# EAGLE design CAN-Test-Board (EAGLE 9.6.2)

## Sheet 1 of 3
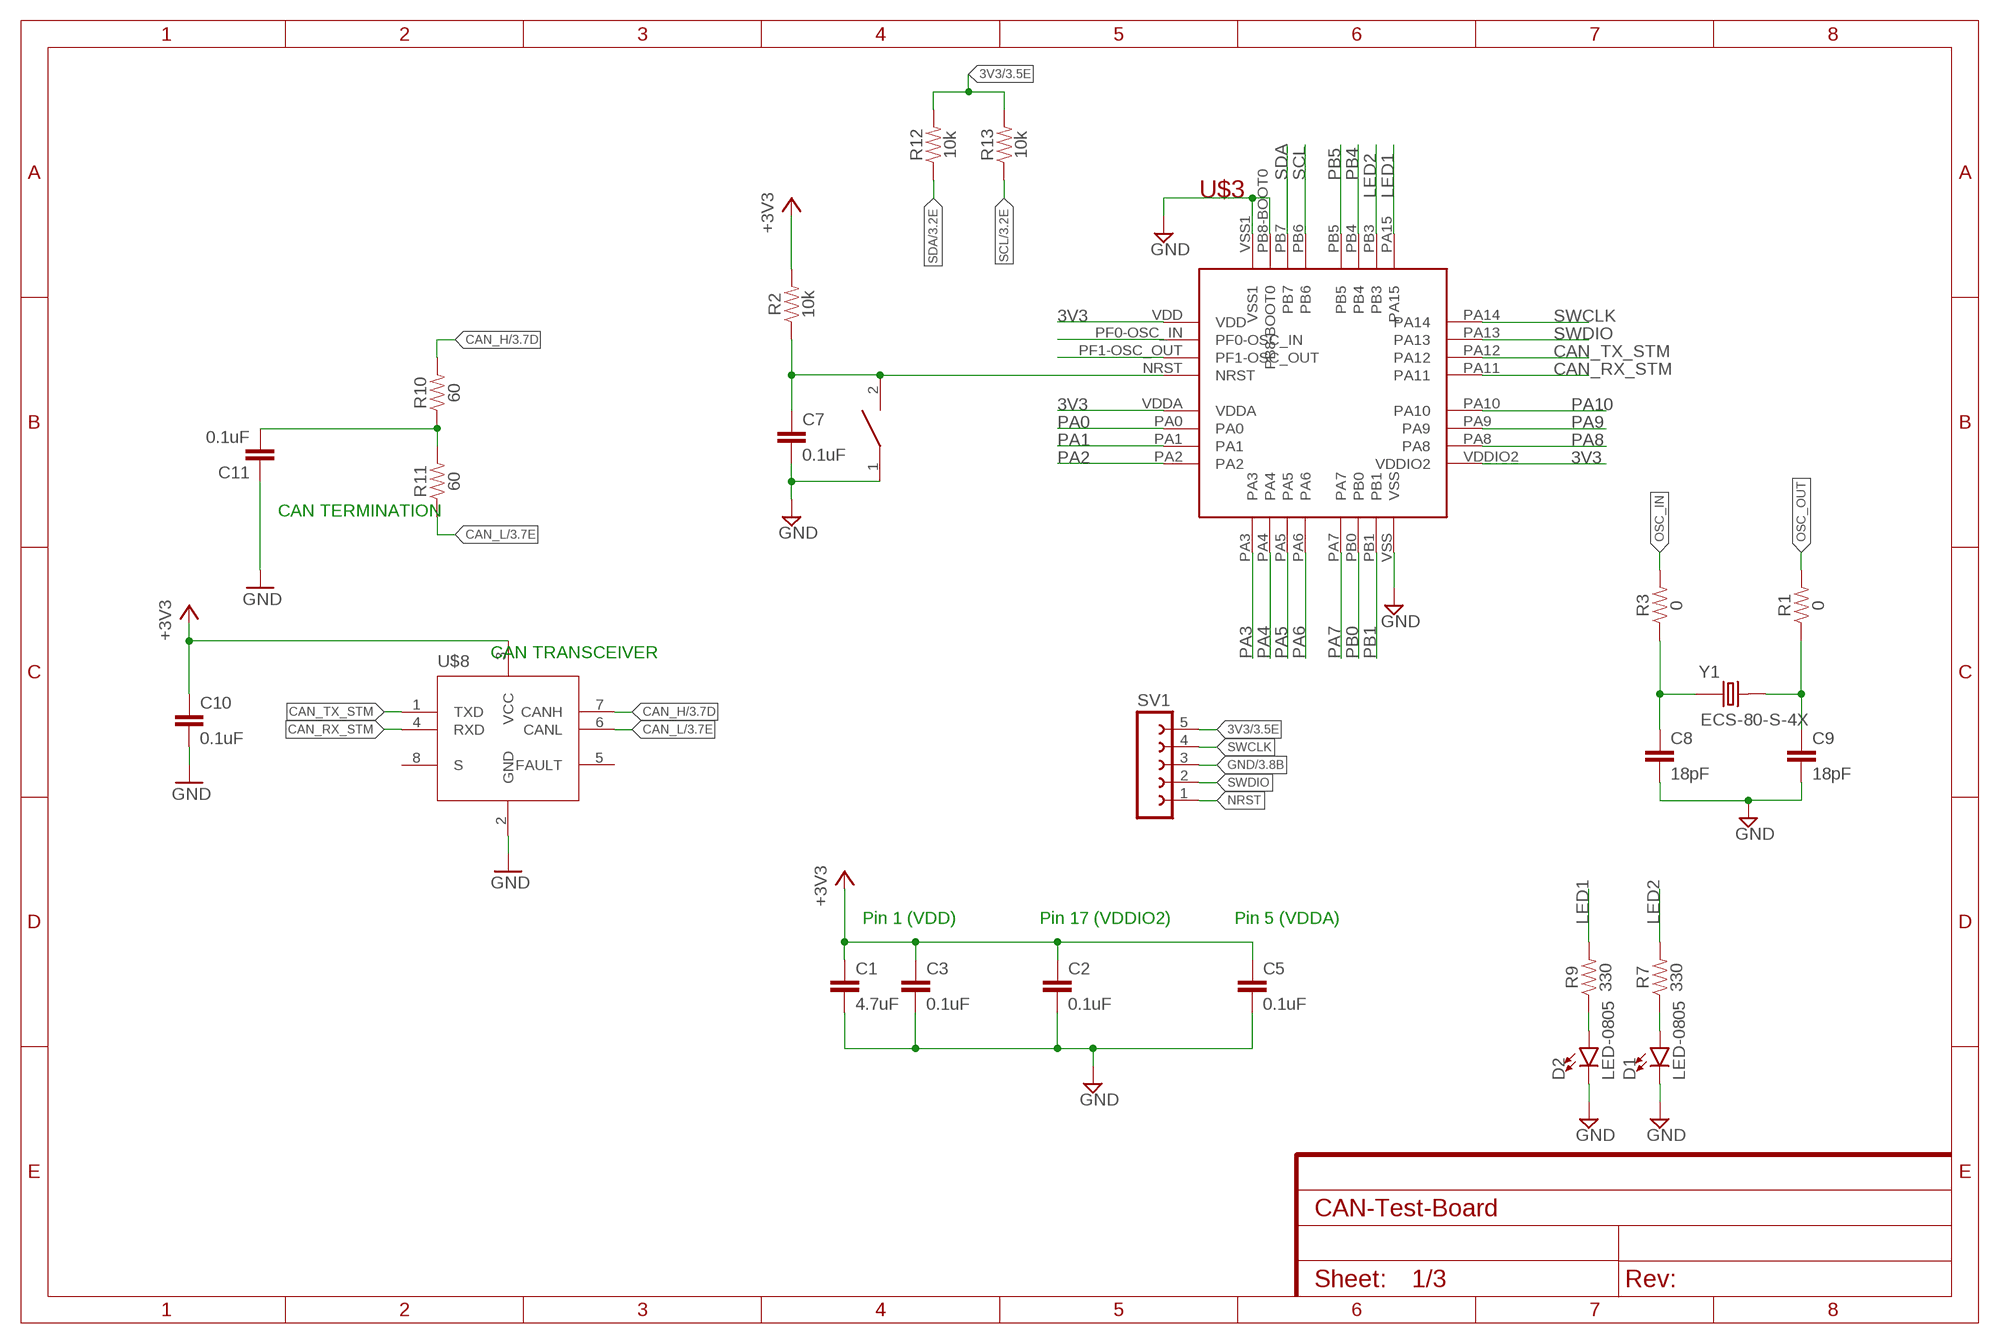
[diagram p0: schematic, sheet 1]

### Parts
C1  4.7uF  4.7UF0603  [0603]
C2  0.1uF  4.7UF0603  [0603]
C3  0.1uF  4.7UF0603  [0603]
C5  0.1uF  4.7UF0603  [0603]
C7  0.1uF  4.7UF0603  [0603]
C8  18pF  4.7UF0603  [0603]
C9  18pF  4.7UF0603  [0603]
C10  0.1uF  4.7UF0603  [0603]
C11  0.1uF  0.1UF-0603-25V-(+80/-20%)  [0603]
D1  LED-0805  [0805]
D2  LED-0805  [0805]
R1  0  1KOHM-0603-1/10W-1%  [0603]
R2  10k  1KOHM-0603-1/10W-1%  [0603]
R3  0  1KOHM-0603-1/10W-1%  [0603]
R7  330  RESISTOR0603  [0603]
R9  330  RESISTOR0603  [0603]
R10  60  1KOHM-0603-1/10W-1%  [0603]
R11  60  1KOHM-0603-1/10W-1%  [0603]
R12  10k  1KOHM-0603-1/10W-1%  [0603]
R13  10k  1KOHM-0603-1/10W-1%  [0603]
RESET  DISCRETECOMPONENTS_SWITCH  [DISCRETECOMPONENTS_SW_2512]
SV1  FE05-1  [FE05-1]
U$3  STM32F042K6T6  [STM32F042K6T6]
U$8  TCAN337D  [SOIC-8]
Y1  ECS-80-S-4X  [XTAL_ECS-80-S-4X]

### Nets
3V3 [Power]: C1.1 C2.1 C3.1 C5.1 C10.1 R2.2 R12.2 R13.2 SV1.5 U$3.VDD U$3.VDDA U$3.VDDIO2 U$8.3(VCC) ; supply symbol labelled +3V3 ; also sheet 2,3
CAN_H [GPIO]: R10.2 U$8.7(CANH) ; also sheet 2,3
CAN_L [GPIO]: R11.1 U$8.6(CANL) ; also sheet 2,3
CAN_RX_STM [GPIO]: U$3.PA11 U$8.4(RXD)
CAN_TX_STM [GPIO]: U$3.PA12 U$8.1(TXD)
GND: C1.2 C2.2 C3.2 C5.2 C7.2 C8.2 C9.2 C10.2 C11.1 D1.C D2.C RESET.1 SV1.3 U$3.PB8-BOOT0 U$3.VSS U$3.VSS1 U$8.2(GND) ; also sheet 2,3
LED1: R9.2 U$3.PA15
LED2: R7.2 U$3.PB3 ; also sheet 2
N$1: C9.1 R1.1 Y1.2
N$2: C8.1 R3.1 Y1.1
N$5: C11.2 R10.1 R11.2
N$13: D2.A R9.1
N$24: D1.A R7.1
NRST [GPIO]: C7.1 R2.1 RESET.2 SV1.1 U$3.NRST
OSC_IN [GPIO]: R3.2 U$3.PF0-OSC_IN
OSC_OUT [GPIO]: R1.2 U$3.PF1-OSC_OUT
PA0 [GPIO]: U$3.PA0 ; also sheet 2
PA1 [GPIO]: U$3.PA1 ; also sheet 2
PA2 [GPIO]: U$3.PA2 ; also sheet 2
PA3 [GPIO]: U$3.PA3 ; also sheet 2
PA4 [GPIO]: U$3.PA4 ; also sheet 2
PA5 [GPIO]: U$3.PA5 ; also sheet 2
PA6 [GPIO]: U$3.PA6 ; also sheet 2
PA7 [GPIO]: U$3.PA7 ; also sheet 2
PA8 [GPIO]: U$3.PA8 ; also sheet 2
PA9 [GPIO]: U$3.PA9 ; also sheet 2
PA10 [GPIO]: U$3.PA10 ; also sheet 2
PB0 [GPIO]: U$3.PB0 ; also sheet 2
PB1 [GPIO]: U$3.PB1 ; also sheet 2
PB4 [GPIO]: U$3.PB4 ; also sheet 2
PB5 [GPIO]: U$3.PB5 ; also sheet 2
SCL [GPIO]: R13.1 U$3.PB6 ; also sheet 2,3
SDA [GPIO]: R12.1 U$3.PB7 ; also sheet 2,3
SWCLK [GPIO]: SV1.4 U$3.PA14
SWDIO [GPIO]: SV1.2 U$3.PA13
Unconnected: U$8.5(FAULT) U$8.8(S)

### Notes on the sheet
- CAN TERMINATION
- CAN TRANSCEIVER
- Pin 1 (VDD) | Pin 17 (VDDIO2) | Pin 5 (VDDA)

## Sheet 2 of 3
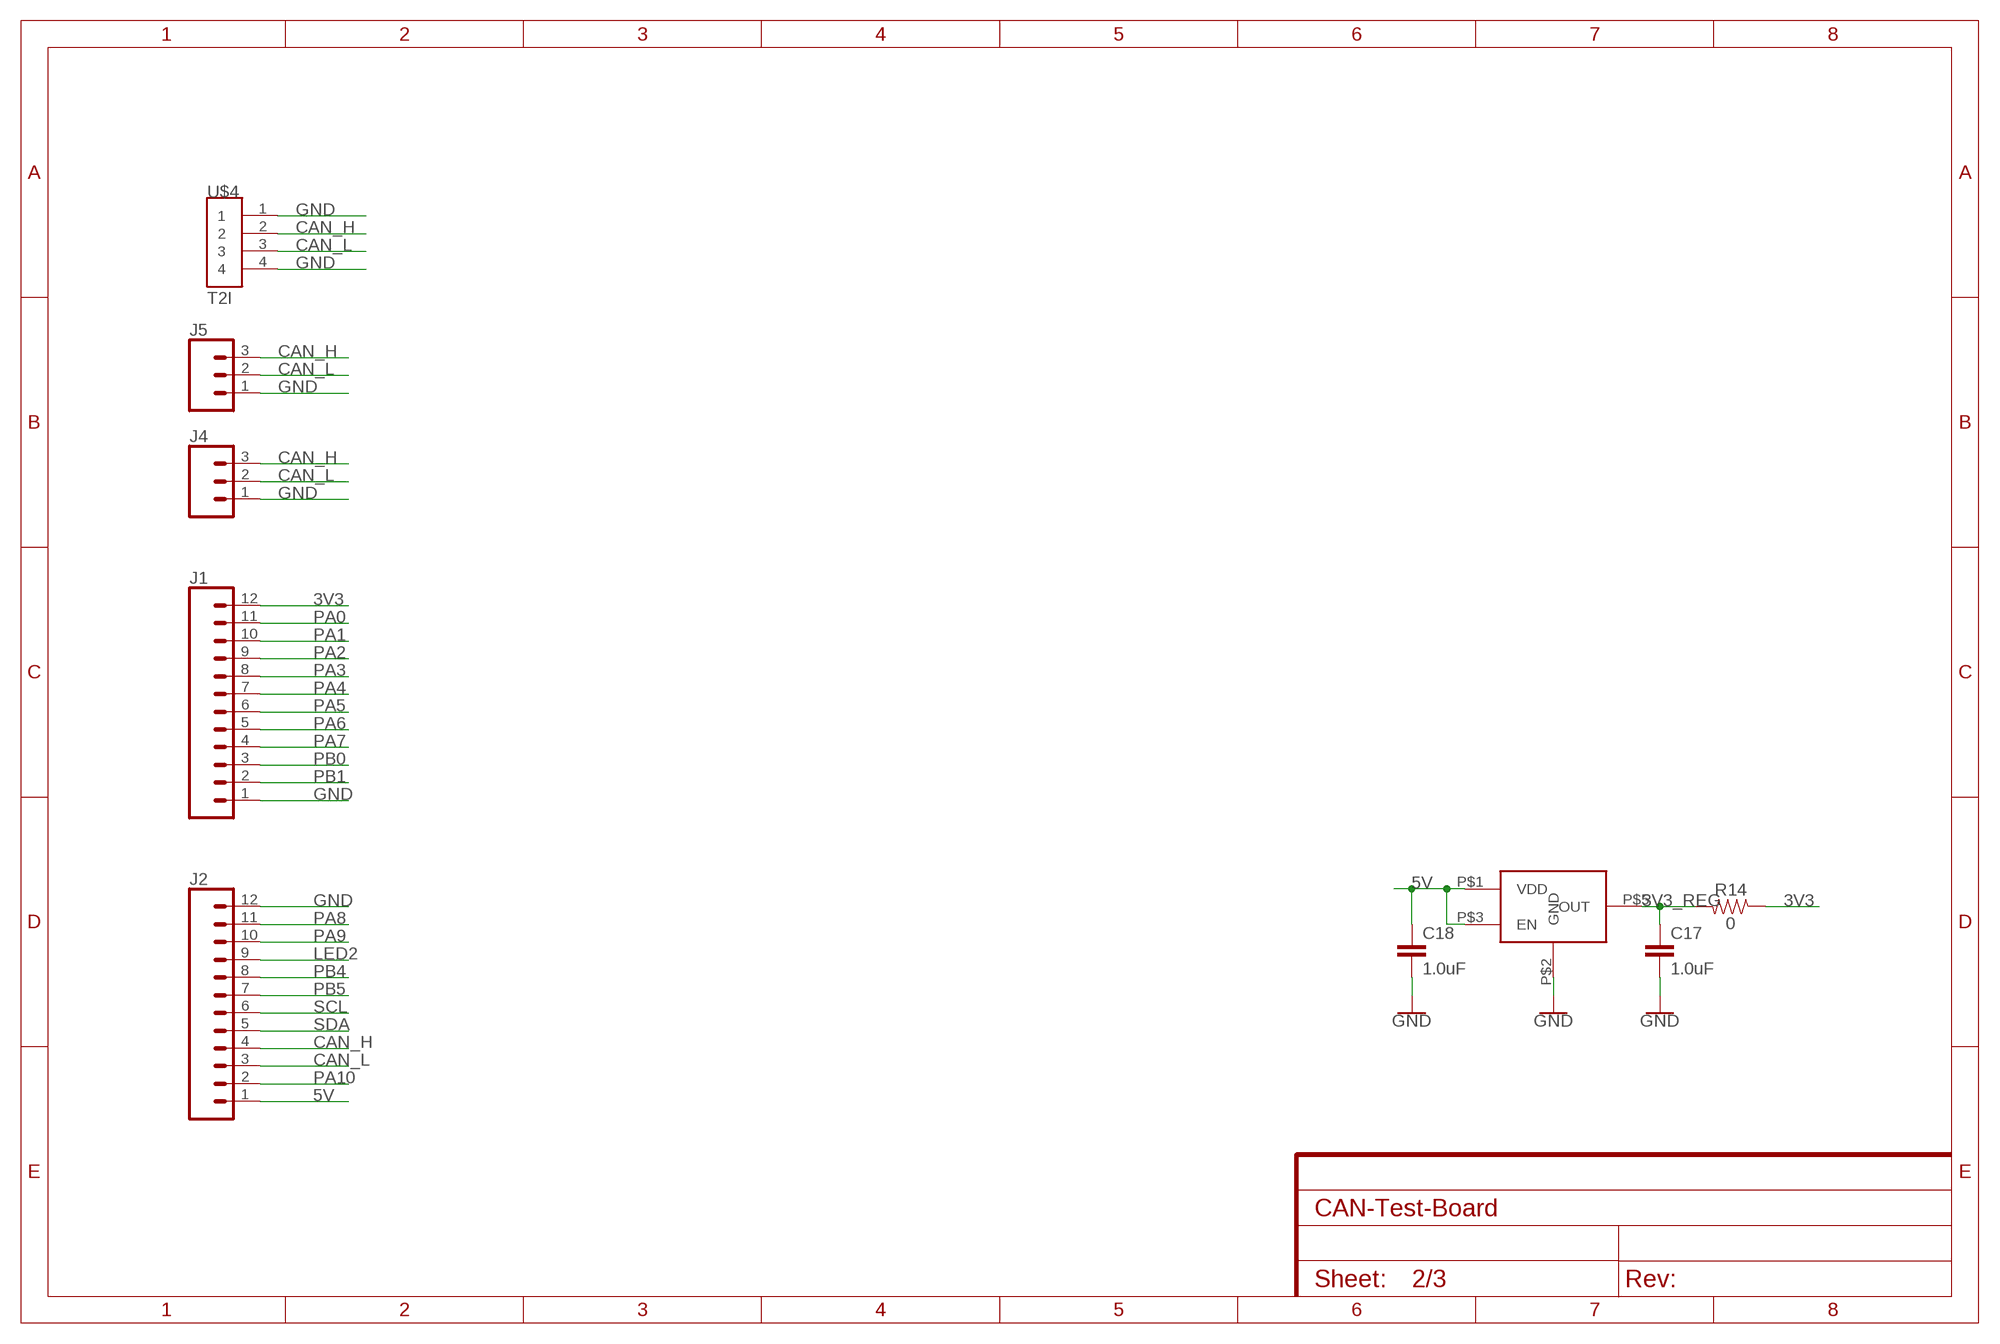
[diagram p1: schematic, sheet 2]

### Parts
C17  1.0uF  1.0UF-0603-16V-10%  [0603]
C18  1.0uF  1.0UF-0603-16V-10%  [0603]
J1  CONN_12  [1X12]
J2  CONN_12  [1X12]
J4  CONN_03  [1X03]
J5  CONN_03  [1X03]
R14  0  RESISTOR0603  [0603]
U$4  T2I  [T2I]
U$5  NCP114  [TSOP-5]

### Nets
3V3 [Power]: J1.12 R14.1 ; also sheet 1,3
3V3_REG [Power]: C17.1 R14.2 U$5.P$5(OUT)
5V [Power]: C18.1 J2.1 U$5.P$1(VDD) U$5.P$3(EN) ; also sheet 3
CAN_H [GPIO]: J2.4 J4.3 J5.3 U$4.2 ; also sheet 1,3
CAN_L [GPIO]: J2.3 J4.2 J5.2 U$4.3 ; also sheet 1,3
GND: C17.2 C18.2 J1.1 J2.12 J4.1 J5.1 U$4.1 U$4.4 U$5.P$2(GND) ; also sheet 1,3
LED2: J2.9 ; also sheet 1
PA0 [GPIO]: J1.11 ; also sheet 1
PA1 [GPIO]: J1.10 ; also sheet 1
PA2 [GPIO]: J1.9 ; also sheet 1
PA3 [GPIO]: J1.8 ; also sheet 1
PA4 [GPIO]: J1.7 ; also sheet 1
PA5 [GPIO]: J1.6 ; also sheet 1
PA6 [GPIO]: J1.5 ; also sheet 1
PA7 [GPIO]: J1.4 ; also sheet 1
PA8 [GPIO]: J2.11 ; also sheet 1
PA9 [GPIO]: J2.10 ; also sheet 1
PA10 [GPIO]: J2.2 ; also sheet 1
PB0 [GPIO]: J1.3 ; also sheet 1
PB1 [GPIO]: J1.2 ; also sheet 1
PB4 [GPIO]: J2.8 ; also sheet 1
PB5 [GPIO]: J2.7 ; also sheet 1
SCL [GPIO]: J2.6 ; also sheet 1,3
SDA [GPIO]: J2.5 ; also sheet 1,3

## Sheet 3 of 3
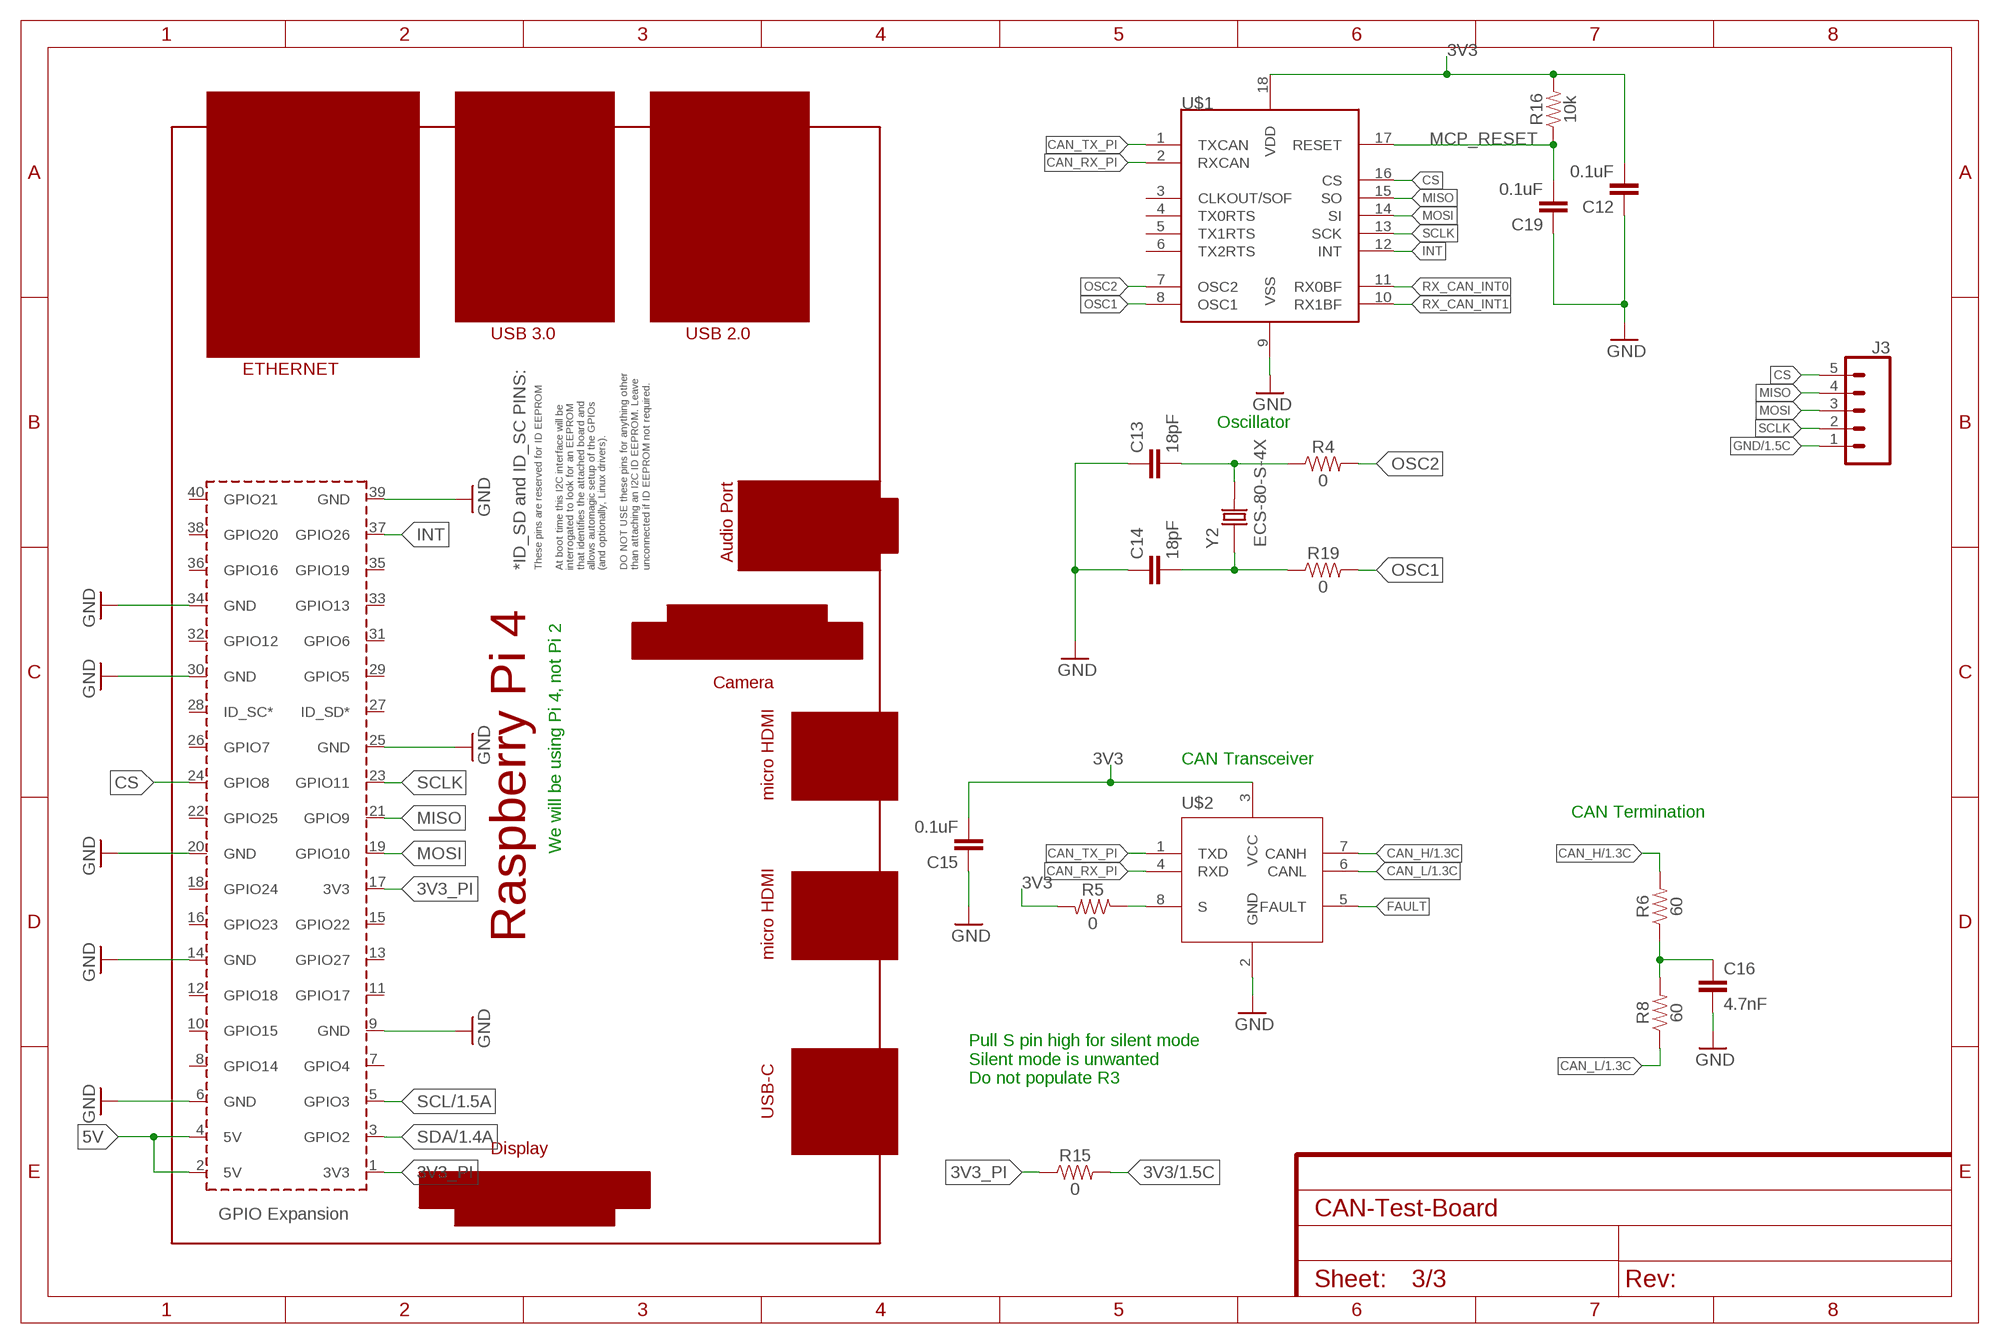
[diagram p2: schematic, sheet 3]

### Parts
C12  0.1uF  22NF/22,000PF-0603-50V-10%  [0603]
C13  18pF  22NF/22,000PF-0603-50V-10%  [0603]
C14  18pF  22NF/22,000PF-0603-50V-10%  [0603]
C15  0.1uF  22NF/22,000PF-0603-50V-10%  [0603]
C16  4.7nF  22NF/22,000PF-0603-50V-10%  [0603]
C19  0.1uF  22NF/22,000PF-0603-50V-10%  [0603]
J3  CONN_05  [1X05]
PCB1  RPI4  [RPI4]
R4  0  RESISTOR0603  [0603]
R5  0  RESISTOR0603  [0603]
R6  60  RESISTOR0603  [0603]
R8  60  RESISTOR0603  [0603]
R15  0  RESISTOR0603  [0603]
R16  10k  1KOHM-0603-1/10W-1%  [0603]
R19  0  RESISTOR0603  [0603]
U$1  MCP2515  [SOIC-18]
U$2  TCAN337D  [SOIC-8]
Y2  ECS-80-S-4X  [XTAL_ECS-80-S-4X]

### Nets
3V3 [Power]: C12.2 C15.2 R5.2 R15.2 R16.2 U$1.18(VDD) U$2.3(VCC) ; also sheet 1,2
3V3_PI [Power]: PCB1.1(3V3) PCB1.17(3V3) R15.1
5V [Power]: PCB1.2(5V) PCB1.4(5V) ; also sheet 2
CAN_H [GPIO]: R6.2 U$2.7(CANH) ; also sheet 1,2
CAN_L [GPIO]: R8.1 U$2.6(CANL) ; also sheet 1,2
CAN_RX_PI [GPIO]: U$1.2(RXCAN) U$2.4(RXD)
CAN_TX_PI [GPIO]: U$1.1(TXCAN) U$2.1(TXD)
CS [GPIO]: J3.5 PCB1.24(GPIO8) U$1.16(CS)
FAULT [GPIO]: U$2.5(FAULT)
GND: C12.1 C13.1 C14.1 C15.1 C16.2 C19.1 J3.1 PCB1.6(GND) PCB1.9(GND) PCB1.14(GND) PCB1.20(GND) PCB1.25(GND) PCB1.30(GND) PCB1.34(GND) PCB1.39(GND) U$1.9(VSS) U$2.2(GND) ; also sheet 1,2
INT: PCB1.37(GPIO26) U$1.12(INT)
MCP_RESET: C19.2 R16.1 U$1.17(RESET)
MISO [GPIO]: J3.4 PCB1.21(GPIO9) U$1.15(SO)
MOSI [GPIO]: J3.3 PCB1.19(GPIO10) U$1.14(SI)
N$7: C16.1 R6.1 R8.2
OSC1 [GPIO]: R19.2 U$1.8(OSC1)
OSC2 [GPIO]: R4.2 U$1.7(OSC2)
OSC_1_MID: C14.2 R19.1 Y2.1
OSC_2_MID: C13.2 R4.1 Y2.2
RX_CAN_INT0: U$1.11(RX0BF)
RX_CAN_INT1: U$1.10(RX1BF)
SCL [GPIO]: PCB1.5(GPIO3) ; also sheet 1,2
SCLK: J3.2 PCB1.23(GPIO11) U$1.13(SCK)
SDA [GPIO]: PCB1.3(GPIO2) ; also sheet 1,2
SILENT_PI: R5.1 U$2.8(S)
Unconnected: PCB1.7(GPIO4) PCB1.8(GPIO14) PCB1.10(GPIO15) PCB1.11(GPIO17) PCB1.12(GPIO18) PCB1.13(GPIO27) PCB1.15(GPIO22) PCB1.16(GPIO23) PCB1.18(GPIO24) PCB1.22(GPIO25) PCB1.26(GPIO7) PCB1.27(ID_SD*) PCB1.28(ID_SC*) PCB1.29(GPIO5) PCB1.31(GPIO6) PCB1.32(GPIO12) PCB1.33(GPIO13) PCB1.35(GPIO19) PCB1.36(GPIO16) PCB1.38(GPIO20) PCB1.40(GPIO21) U$1.3(CLKOUT/SOF) U$1.4(TX0RTS) U$1.5(TX1RTS) U$1.6(TX2RTS)

### Notes on the sheet
- Oscillator
- CAN Transceiver
- CAN Termination
- We will be using Pi 4, not Pi 2
- Pull S pin high for silent mode
  Silent mode is unwanted
  Do not populate R3

## Library data of the parts
C1 = SparkFun-Capacitors:4.7UF: 4.7µF ceramic capacitors A capacitor is a passive two-terminal electrical component used to store electrical energy temporarily in an electric field.; PROD_ID: CAP-08280
C2 C3 C5 C7-C10 = SparkFun-Capacitors:4.7UF: 4.7µF ceramic capacitors A capacitor is a passive two-terminal electrical component used to store electrical energy temporarily in an electric field.; PROD_ID: CAP-08280; VALUE: 4.7uF
C11 = SparkFun-Capacitors:0.1UF: 0.1µF ceramic capacitors A capacitor is a passive two-terminal electrical component used to store electrical energy temporarily in an electric field.; PROD_ID: CAP-00810
C12-C16 C19 = SparkFun-Capacitors:22NF/22,000PF: 0.022uF/22nF/22,000pF ceramic capacitors A capacitor is a passive two-terminal electrical component used to store electrical energy temporarily in an electric field.; PROD_ID: CAP-07885; VALUE: 22nF
C17 C18 = SparkFun-Capacitors:1.0UF: 1µF ceramic capacitors A capacitor is a passive two-terminal electrical component used to store electrical energy temporarily in an electric field.; PROD_ID: CAP-00868
D1 D2 = LED-0805:LED-0805
J1 J2 = SparkFun-Connectors:CONN_12: Multi connection point. Often used as Generic Header-pin footprint for 0.1 inch spaced/style header connections On any of the 0.1 inch spaced packages, you can populate with these: Break Away Headers - Straight <https://www.sparkfun.com/products/116> (PRT-00116) Break Away Male Headers - Right Angle <https://www.sparkfun.com/products/553> (PRT-00553) Female Headers <https://www.sparkfun.com/products/115> (PRT-00115) Break Away Headers - Machine Pin <https://www.sparkfun.com/products/117> (PRT-00117) Break Away Female Headers - Swiss Machine Pin <https://www.sparkfun.com/products/743> (PRT-00743) For SCREWTERMINALS and SPRING TERMINALS visit here: Screw Terimnals on SparkFun.com <https://www.sparkfun.com/search/results?term=Screw+Terminals> (5mm/3.5mm/2.54mm spacing) This device is also useful as a general connection point to wire up your design to another part of your project. Our various solder wires solder well into these plated through hole pads. Hook-Up Wire - Assortment (Stranded, 22 AWG) <https://www.sparkfun.com/products/11375> (PRT-11375) Hook-Up Wire - Assortment (Solid Core, 22 AWG) <https://www.sparkfun.com/products/11367> (PRT-11367) View the entire wire category on our website here <https://www.sparkfun.com/categories/141> Special notes: Molex polarized connector foot print use with SKU : PRT-08231 with associated crimp pins and housings. 1MM SMD Version SKU: PRT-10208 NOTES ON THE VARIANTS LOCK and LOCK_LONGPADS... This footprint was designed to help hold the alignment of a through-hole component (i.e. 6-pin header) while soldering it into place. You may notice that each hole has been shifted either up or down by 0.005 of an inch from it's more standard position (which is a perfectly straight line). This slight alteration caused the pins (the squares in the middle) to touch the edges of the holes. Because they are alternating, it causes a "brace" to hold the component in place. 0.005 has proven to be the perfect amount of "off-center" position when using our standard breakaway headers. Although looks a little odd when you look at the bare footprint, once you have a header in there, the alteration is very hard to notice. Also,if you push a header all the way into place, it is covered up entirely on the bottom side.
J3 = SparkFun-Connectors:CONN_05: Multi connection point. Often used as Generic Header-pin footprint for 0.1 inch spaced/style header connections On any of the 0.1 inch spaced packages, you can populate with these: Break Away Headers - Straight <https://www.sparkfun.com/products/116> (PRT-00116) Break Away Male Headers - Right Angle <https://www.sparkfun.com/products/553> (PRT-00553) Female Headers <https://www.sparkfun.com/products/115> (PRT-00115) Break Away Headers - Machine Pin <https://www.sparkfun.com/products/117> (PRT-00117) Break Away Female Headers - Swiss Machine Pin <https://www.sparkfun.com/products/743> (PRT-00743) For SCREWTERMINALS and SPRING TERMINALS visit here: Screw Terimnals on SparkFun.com <https://www.sparkfun.com/search/results?term=Screw+Terminals> (5mm/3.5mm/2.54mm spacing) This device is also useful as a general connection point to wire up your design to another part of your project. Our various solder wires solder well into these plated through hole pads. Hook-Up Wire - Assortment (Stranded, 22 AWG) <https://www.sparkfun.com/products/11375> (PRT-11375) Hook-Up Wire - Assortment (Solid Core, 22 AWG) <https://www.sparkfun.com/products/11367> (PRT-11367) View the entire wire category on our website here <https://www.sparkfun.com/categories/141> Special notes: Molex polarized connector foot print use with SKU : PRT-08231 with associated crimp pins and housings. 1MM SMD Version SKU: PRT-10208
J4 J5 = SparkFun-Connectors:CONN_03: Multi connection point. Often used as Generic Header-pin footprint for 0.1 inch spaced/style header connections On any of the 0.1 inch spaced packages, you can populate with these: Break Away Headers - Straight <https://www.sparkfun.com/products/116> (PRT-00116) Break Away Male Headers - Right Angle <https://www.sparkfun.com/products/553> (PRT-00553) Female Headers <https://www.sparkfun.com/products/115> (PRT-00115) Break Away Headers - Machine Pin <https://www.sparkfun.com/products/117> (PRT-00117) Break Away Female Headers - Swiss Machine Pin <https://www.sparkfun.com/products/743> (PRT-00743) Stackable Header - 3 Pin (Female, 0.1") <https://www.sparkfun.com/products/13875> (PRT-13875) For SCREWTERMINALS and SPRING TERMINALS visit here: Screw Terimnals on SparkFun.com <https://www.sparkfun.com/search/results?term=Screw+Terminals> (5mm/3.5mm/2.54mm spacing) This device is also useful as a general connection point to wire up your design to another part of your project. Our various solder wires solder well into these plated through hole pads. Hook-Up Wire - Assortment (Stranded, 22 AWG) <https://www.sparkfun.com/products/11375> (PRT-11375) Hook-Up Wire - Assortment (Solid Core, 22 AWG) <https://www.sparkfun.com/products/11367> (PRT-11367) View the entire wire category on our website here <https://www.sparkfun.com/categories/141> Special notes: Molex polarized connector foot print use with SKU : PRT-08232 with associated crimp pins and housings.
PCB1 = AUX, RaspberryPi:RPI4
R1-R3 R10-R13 R16 = SparkFun-Resistors:1KOHM: 1kΩ resistor A resistor is a passive two-terminal electrical component that implements electrical resistance as a circuit element. Resistors act to reduce current flow, and, at the same time, act to lower voltage levels within circuits. - Wikipedia; PROD_ID: RES-07856; VALUE: 1k
R4-R9 R14 R15 R19 = SparkFun-Resistors:RESISTOR: Generic Resistor Package
RESET = Push button:DISCRETECOMPONENTS_SWITCH
SV1 = con-lsta:FE05-1: FEMALE HEADER; OC_FARNELL: unknown; OC_NEWARK: unknown
U$1 = IC, STM and CAN parts:MCP2515
U$2 U$8 = IC, STM and CAN parts:TCAN337D
U$3 = PI_Shield_Library:STM32F042K6T6
U$4 = Samtec t2i:T2I
U$5 = LED_lib:NCP114
Y1 Y2 = ECS-80-S-4X:ECS-80-S-4X: CRYSTAL T/H; DESCRIPTION: Crystal 8MHz Series 2-Pin HC-49/U; DIGI-KEY_PART_NUMBER: X1057-ND; DIGI-KEY_PURCHASE_URL: https://www.digikey.com/product-detail/en/ecs-inc/ECS-80-S-4X/X1057-ND/827549?utm_source=snapeda&utm_medium=aggregator&utm_campaign=symbol; MF: ECS International; MP: ECS-80-S-4X; PACKAGE: HC-49/US ECS International

## Net classes
1 GPIO: width 0.203 mm
2 Power: width 0.61 mm

## Board
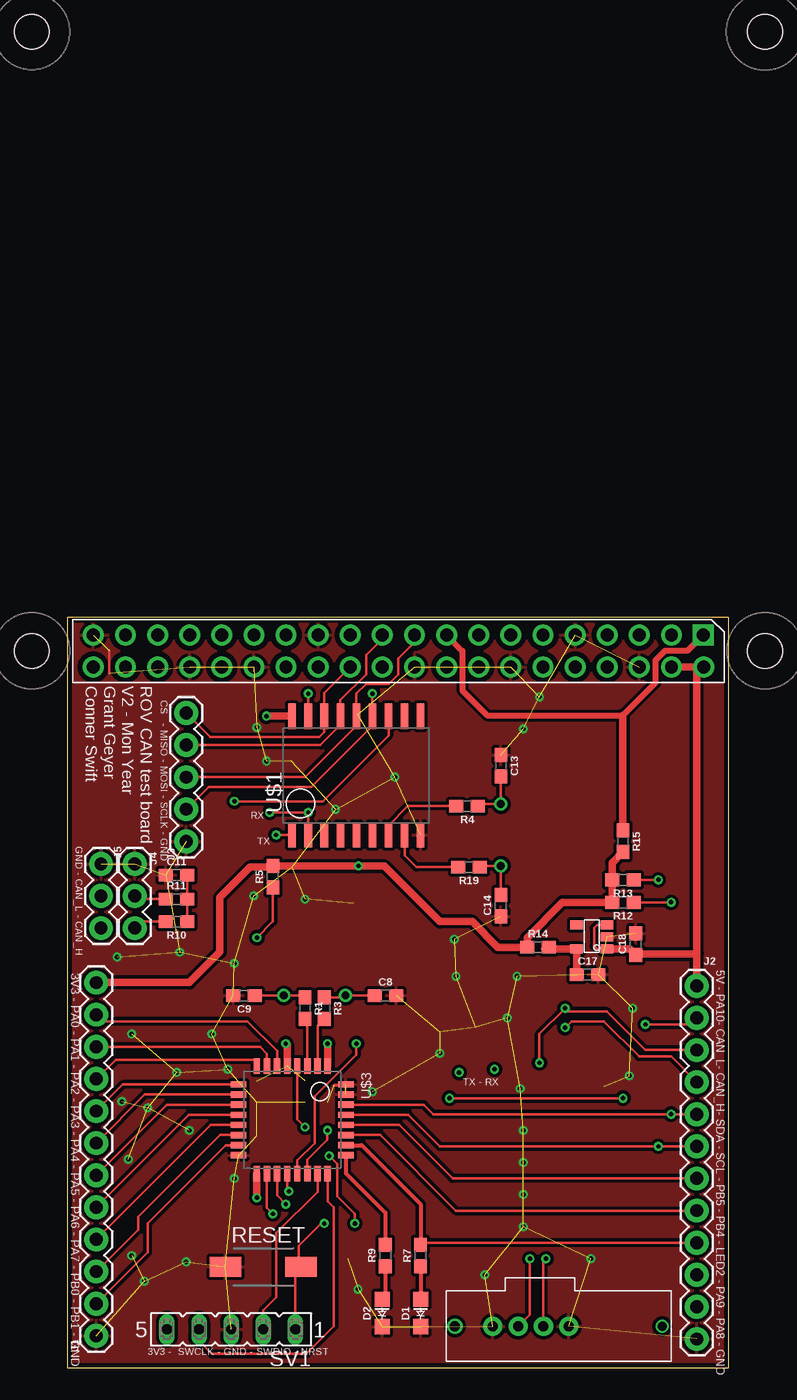
[diagram p3: board, top side]
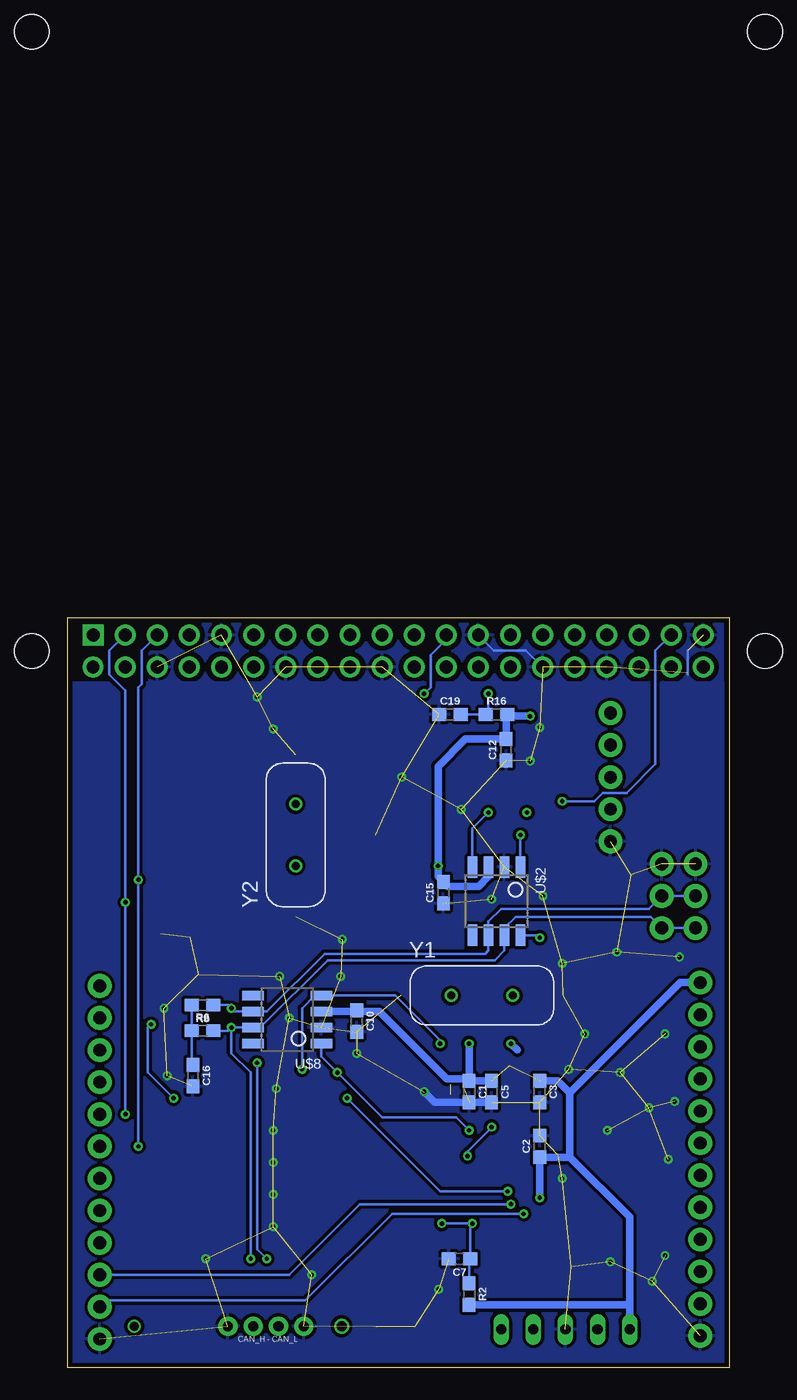
[diagram p4: board, bottom side, seen from below]

Size 52.3 x 59.36 mm. Coordinates in mm from the lower left corner, seen from the top.
Outline: 0,0 52.3,0 52.3,59.36 0,59.36 0,0
Copper layers (1*16): Top 0.0356mm / dielectric 1.5011mm / Bottom 0.0356mm
Design rules "ECE_Senior_Design": minimum track width 8mil, minimum drill 13mil, track to track 8mil, track to pad 8mil, pad to pad 6mil, via to via 8mil, smd to smd 6mil, copper to edge 15mil, drill to drill 8mil, minimum pad ring 7mil, minimum via ring 7mil, stop-mask expansion 3mil, vias tented up to drill 0mil, thermal gap 10mil

### Footprints (pad centres in the part's own frame; a part is rotated, then mirrored left to right if it is on the bottom)
0603 = smd 1.1 x 1: 1 -0.85,0; 2 0.85,0
0805 = smd 1.2 x 1.2: A 1.1,0; C -1.05,0
1X12 = drill 1.016 pad 1.88: 1 0,0; 2 2.54,0; 3 5.08,0; 4 7.62,0; 5 10.16,0; 6 12.7,0; 7 15.24,0; 8 17.78,0; 9 20.32,0; 10 22.86,0; 11 25.4,0; 12 27.94,0
1X05 = drill 1.016 pad 1.88: 1 0,0; 2 2.54,0; 3 5.08,0; 4 7.62,0; 5 10.16,0
1X03 = drill 1.016 pad 1.88: 1 0,0; 2 2.54,0; 3 5.08,0
RPI4 = drill 1.016 pad 1.651 square: 1 8.37,51.23 | drill 1.016 pad 1.651: 2 8.357,53.772; 3 10.897,51.232; 4 10.897,53.772; 5 13.437,51.232; 6 13.437,53.772; 7 15.977,51.232; 8 15.977,53.772; 9 18.517,51.232; 10 18.517,53.772; 11 21.057,51.232; 12 21.057,53.772; 13 23.597,51.232; 14 23.597,53.772; 15 26.137,51.232; 16 26.137,53.772; 17 28.677,51.232; 18 28.677,53.772; 19 31.217,51.232; 20 31.217,53.772; 21 33.757,51.232; 22 33.757,53.772; 23 36.297,51.232; 24 36.297,53.772; 25 38.837,51.232; 26 38.837,53.772; 27 41.377,51.232; 28 41.377,53.772; 29 43.917,51.232; 30 43.917,53.772; 31 46.457,51.232; 32 46.457,53.772; 33 48.997,51.232; 34 48.997,53.772; 35 51.537,51.232; 36 51.537,53.772; 37 54.077,51.232; 38 54.077,53.772; 39 56.617,51.232; 40 56.617,53.772 | hole 2.75: 3.5,3.5; 61.5,3.5; 3.5,52.5; 61.5,52.5
DISCRETECOMPONENTS_SW_2512 = smd 2.5 x 1.6: 1 -3,0; 2 3,0
FE05-1 = drill 0.813 long: 1 -5.08,0; 2 -2.54,0; 3 0,0; 4 2.54,0; 5 5.08,0
SOIC-18 = smd 2 x 0.6: 1 0,10.16; 2 0,8.89; 3 0,7.62; 4 0,6.35; 5 0,5.08; 6 0,3.81; 7 0,2.54; 8 0,1.27; 9 0,0; 10 9.4,0; 11 9.4,1.27; 12 9.4,2.54; 13 9.4,3.81; 14 9.4,5.08; 15 9.4,6.35; 16 9.4,7.62; 17 9.4,8.89; 18 9.4,10.16
SOIC-8 = smd 1.7 x 0.75: 1 0,3.81; 2 0,2.54; 3 0,1.27; 4 0,0; 5 5.4,0; 6 5.4,1.27; 7 5.4,2.54; 8 5.4,3.81
STM32F042K6T6 = smd 1.2 x 0.5: NRST 0,3.2; PA0 0,1.6; PA1 0,0.8; PA2 0,0; PA8 8.5,0.8; PA9 8.5,1.6; PA10 8.5,2.4; PA11 8.5,3.2; PA12 8.5,4; PA13 8.5,4.8; PA14 8.5,5.6; PF0-OSC_IN 0,4.8; PF1-OSC_OUT 0,4; VDD 0,5.6; VDDA 0,2.4; VDDIO2 8.5,0 | smd 0.5 x 1.2: PA3 1.45,-1.45; PA4 2.25,-1.45; PA5 3.05,-1.45; PA6 3.85,-1.45; PA7 4.65,-1.45; PA15 7.05,7.05; PB0 5.45,-1.45; PB1 6.25,-1.45; PB3 6.25,7.05; PB4 5.45,7.05; PB5 4.65,7.05; PB6 3.85,7.05; PB7 3.05,7.05; PB8-BOOT0 2.25,7.05; VSS 7.05,-1.45; VSS1 1.45,7.05
T2I = drill 0.8 pad 1.524: 1 8.1,2.8; 2 10.1,2.8; 3 12.1,2.8; 4 14.1,2.8 | drill 0.7: S1 0.7,2.8 | drill 0.8: S2 17.1,2.8
TSOP-5 = smd 0.7 x 1: P$1 1.9,0; P$2 0.95,0; P$3 0,0; P$4 0,-2.4; P$5 1.9,-2.4
XTAL_ECS-80-S-4X = drill 0.63 pad 1.03: 1 -2.44,0; 2 2.44,0

### Placement (x,y rotation side)
C1  20.57,21.84 270 bottom
C2  14.99,17.53 90 bottom
C3  14.99,21.84 270 bottom
C5  18.8,21.84 270 bottom
C7  21.34,8.64 180 bottom
C8  25.15,29.46 0 top
C9  13.97,29.46 180 top
C10  29.46,27.43 270 bottom
C11  8.64,38.99 0 top
C12  17.65,48.9 90 bottom
C13  34.29,47.62 270 top
C14  34.29,36.58 90 top
C15  22.61,37.59 90 bottom
C16  42.42,23.11 270 bottom
C17  41.15,31.11 0 top
C18  44.96,33.53 90 top
C19  22.1,51.69 0 bottom
D1  27.94,4.32 90 top
D2  24.89,4.32 90 top
J1  2.29,2.54 90 top
J2  49.78,30.23 270 top
J3  9.4,41.66 90 top
J4  5.33,39.88 270 top
J5  2.67,39.88 270 top
PCB1  58.67,109.22 180 top
R1  18.8,28.45 270 top
R2  20.57,5.84 270 bottom
R3  20.32,28.45 270 top
R4  31.62,44.45 180 top
R5  16.26,38.86 90 top
R6  41.66,26.67 0 bottom
R7  27.94,8.89 90 top
R8  41.66,28.7 180 bottom
R9  25.15,8.89 90 top
R10  8.64,35.31 180 top
R11  8.64,37.08 0 top
R12  43.94,36.83 180 top
R13  43.94,38.61 180 top
R14  37.21,33.27 0 top
R15  43.94,41.66 270 top
R16  18.41,51.69 0 bottom
R19  31.75,39.62 180 top
RESET  15.49,8 0 top
SV1  12.95,3.05 180 top
U$1  27.94,42.16 90 top
U$2  20.32,39.62 270 bottom
U$3  14.99,23.88 270 top
U$4  47.75,6.1 180 top
U$5  42.67,35.05 270 top
U$8  32.26,29.46 180 bottom
Y1  19.56,29.46 0 bottom
Y2  34.29,42.16 90 bottom

### Tracks (layer width: path | path; a pad name or v marks a point on that pad's centre or on a via)
3V3  (via drill 0.35)  (2 unrouted)
  Top 0.61: v17.27,25.65 17.39,25.54 U$3.VDDA | v20.57,25.65 20.59,25.64 U$3.VDD | v14.99,13.46 U$3.VDDIO2 | R15.2 43.09,39.96 R13.2 R12.2 39.16,36.83 36.36,34.04 R14.1 34.04,33.27 32,35.31 29.46,35.31 25.06,39.71 v23.03,39.71 R5.2 16.17,39.62 14.48,39.62 12.06,37.21 12.06,32.89 9.65,30.48 J1.12 | U$1.18 v15.75,51.56
  Bottom 0.61: 16.76,25.15 v17.27,25.65 | C5.1 C1.1 | C1.1 v20.57,25.65 | v14.99,13.46 C2.1 12.61,16.68 | SV1.5 7.87,5.08 | 7.87,5.08 7.87,11.94 12.61,16.68 | 12.61,16.68 12.61,21.76 | C3.1 13.55,22.69 12.61,21.76 | 12.61,21.76 3.89,30.48 J1.12 | R2.2 7.96,4.99 7.87,5.08 | U$8.3 29.55,28.19 | 29.55,28.19 C10.1 | C1.1 20.74,22.86 22.35,22.86 27.69,28.19 29.55,28.19 | U$2.3 19.05,38.86 19.81,38.1 22.26,38.1 C15.2 23.03,38.86 v23.03,39.71 23.03,47.59 20.87,49.74 C12.2 17.65,51.6 R16.2 17.44,51.56 v15.75,51.56 15.84,51.56
3V3_PI
  Top 0.457: PCB1.1 49.03,56.72 47.25,56.72 46.51,55.97 46.51,54.19 43.94,51.63 33.21,51.63 31.24,53.59 31.24,56.72 PCB1.17
  Top 0.61: 43.94,51.63 R15.1
3V3_REG
  Top 0.61: C17.1 40.27,31.17 U$5.P$5 37.75,33.15 R14.2
5V
  Top 0.203: U$5.P$3 41.91,35.05 41.66,34.8 41.66,33.37 41.87,33.15 U$5.P$1
  Top 0.61: U$5.P$1 44.48,33.15 C18.1 45.05,32.77 49.78,32.77 | PCB1.4 PCB1.2 50.06,55.45 49.78,55.17 49.78,32.77 | J2.1 49.78,32.77
CAN_H  (via drill 0.35)
  Top 0.203: v39.37,26.92 39.88,27.43 42.42,27.43 45.21,24.64 47.75,24.64 J2.4 | U$4.2 37.65,8.44 v37.85,8.64 | R10.2 5.84,35.31 J4.3
  Bottom 0.203: v39.37,26.92 U$8.7 37.08,26.92 31.75,32.26 18.54,32.26 17.78,33.02 U$2.7 17.78,34.8 16.89,35.69 6.22,35.69 J4.3 J5.3 | v39.37,26.92 39.62,26.67 R6.2 | v39.37,26.92 39.37,24.89 37.85,23.37 v37.85,8.64
CAN_L  (via drill 0.35)
  Top 0.203: J2.3 45.72,25.15 42.67,28.19 39.62,28.19 v39.37,28.45 37.34,26.42 v37.34,24.13 | U$4.3 36.58,4.22 v36.58,8.64 | R11.1 5.59,37.08 J4.2
  Bottom 0.203: R8.1 39.62,28.7 v39.37,28.45 39.12,28.19 U$8.6 36.58,28.19 32,32.77 19.3,32.77 19.05,33.02 U$2.6 19.05,35.31 18.03,36.32 6.35,36.32 J4.2 J5.2 | v36.58,8.64 37.34,9.4 v37.34,24.13
CAN_RX_PI  (via drill 0.35)
  Top 0.203: U$1.2 v19.05,43.94 v16,43.94
  Bottom 0.203: v19.05,43.94 20.32,42.67 U$2.4
CAN_RX_STM  (via drill 0.35)
  Top 0.203: v22.86,25.65 22.86,24.77 19.56,21.46 19.56,17.78 18.19,16.41 U$3.PA11
  Bottom 0.203: v22.86,25.65 22.86,25.91 26.42,29.46 U$8.4 32.77,29.46 33.78,28.45 v33.78,23.62
CAN_TX_PI  (via drill 0.35)
  Top 0.203: U$1.1 v16.51,42.16
  Bottom 0.203: v16.51,42.16 U$2.1
CAN_TX_STM  (via drill 0.35)
  Top 0.203: U$3.PA12 18.99,16.45 20.57,18.03 v20.57,18.8
  Bottom 0.203: v20.57,18.8 21.59,19.81 27.43,19.81 v30.99,23.37 32.26,24.64 U$8.1
CS
  Top 0.203: PCB1.24 20.32,53.39 U$1.16 20.32,50.29 19.94,49.91 11.3,49.91 J3.5
GND  (via drill 0.35)  (80 unrouted)
  Top 0.203: U$3.VSS1 21.96,22.35 21.08,22.35 | 3.3,56.74 3.3,54.99
  Bottom 0.203: 3.3,56.74 3.3,54.86 | PCB1.30 16.08,56.77 18.62,56.77 PCB1.25
  Bottom 0.61: C5.2 C1.2 23.28,20.99 v24.13,21.84
  other vias: 9.4,8.38 6.1,6.86 33.02,7.37 41.4,8.64 36.07,11.18 36.07,13.72 36.07,16.26 36.07,18.8 35.81,22.1 29.46,24.89 13.21,14.99 8.64,23.37 12.7,23.62 22.99,6.22 34.8,27.69 35.56,30.99 30.73,30.99 44.7,28.45 44.45,23.11 36.07,50.55 13.21,32 5.08,8.89 9.65,18.8 6.35,20.57 4.83,16.51 4.32,21.08 5.08,26.42 11.43,26.42 18.8,37.08 14.73,37.34 3.94,32.51 8.89,32.89 14.99,50.67 15.75,48.01 21.21,44.2 25.91,46.74 30.61,33.91 37.34,53.09
  pour Top (isolate 0.254): -3.56,-2.29 55.63,-2.29 55.63,54.23 -3.56,54.23
  pour Bottom (isolate 0.254): -2.03,-1.02 57.15,-1.02 57.15,54.23 -2.03,54.23
  pour Top (isolate 0.406): -2.16,53.59 -2.16,62.23 54.74,62.23 54.74,53.59
  pour Bottom (isolate 0.406): -2.03,53.98 53.34,53.98 53.34,61.34 -2.03,61.34
INT  (via drill 0.35)
  Top 0.203: U$1.12 25.4,50.04 20.19,44.83 v13.21,44.83
  Bottom 0.203: v13.21,44.83 10.67,44.83 10.01,45.49 8.12,45.49 5.84,47.77 5.84,56.74 PCB1.37
LED1
  Top 0.305: U$3.PA15 22.04,15.39 25.15,12.28 R9.2
LED2
  Top 0.203: J2.9 27.94,9.91
  Top 0.305: U$3.PB3 23.27,17.63 27.94,12.95 27.94,9.91 R7.2
MCP_RESET  (via drill 0.35)
  Top 0.203: U$1.17 v19.05,53.34
  Bottom 0.203: C19.2 R16.1 19.05,51.9 v19.05,53.34
MISO
  Top 0.203: PCB1.21 24.92,57.68 23.62,56.39 23.62,54.86 21.59,52.83 U$1.15 21.59,50.85 20.02,49.28 J3.4
MOSI
  Top 0.203: PCB1.19 27.46,57.43 26.16,56.13 26.16,54.86 25.4,54.1 23.62,54.1 22.86,53.34 U$1.14 22.86,50.8 18.8,46.74 J3.3
N$1
  Top 0.203: C9.1 Y1.2 18.63,29.46 R1.1
N$2
  Top 0.203: R3.1 21.83,29.3 Y1.1 C8.1
N$5
  Top 0.203: C11.2 R11.2 R10.1
N$7
  Bottom 0.203: R8.2 R6.1 42.51,24.05 C16.1
N$13
  Top 0.305: R9.1 25.15,5.67 D2.A
N$24
  Top 0.305: R7.1 D1.A
NRST  (via drill 0.35)
  Top 0.203: v20.32,11.43 20.07,11.43 18.29,9.66 18.29,8.2 RESET.2 18.03,7.54 SV1.1 | v18.8,19.05 18.19,19.66 U$3.NRST | v22.73,11.43 22.73,12.19 21.34,13.59 21.34,16.13 v20.7,16.76
  Bottom 0.203: R2.1 20.57,8.55 C7.1 20.49,11.26 v20.32,11.43 v22.73,11.43 | v18.8,19.05 20.7,17.14 v20.7,16.76
OSC1
  Top 0.203: R19.2 27.6,39.62 26.67,40.55 U$1.8
OSC2
  Top 0.203: R4.2 26.92,44.45 25.4,42.93 U$1.7
OSC_1_MID
  Top 0.203: R19.1 32.7,39.72 Y2.1 C14.2
OSC_2_MID
  Top 0.203: R4.1 32.63,44.6 Y2.2 C13.2
OSC_IN
  Top 0.203: U$3.PF0-OSC_IN 19.79,27.06 R3.2
OSC_OUT
  Top 0.203: R1.2 18.99,27.41 U$3.PF1-OSC_OUT
PA0
  Top 0.203: J1.11 2.79,27.43 14.22,27.43 16.59,25.07 U$3.PA0
PA1
  Top 0.203: U$3.PA1 15.79,24.85 15.24,25.4 J1.10
PA2
  Top 0.203: J1.9 3.81,24.38 14.99,24.38 U$3.PA2
PA3
  Top 0.203: U$3.PA3 4.39,22.43 J1.8
PA4
  Top 0.203: U$3.PA4 6.13,21.63 J1.7
PA5
  Top 0.203: U$3.PA5 7.87,20.83 J1.6
PA6
  Top 0.203: U$3.PA6 9.61,20.03 J1.5
PA7
  Top 0.203: U$3.PA7 11.35,19.23 J1.4
PA8  (via drill 0.35)
  Top 0.203: U$3.PA8 15.79,12.66 v16.26,12.19
  Bottom 0.203: v16.26,12.19 26.67,12.19 33.53,5.33 49.28,5.33 J2.11
PA9  (via drill 0.35)
  Top 0.203: U$3.PA9 16.59,13.64 v17.27,12.95
  Bottom 0.203: v17.27,12.95 29.21,12.95 34.8,7.37 J2.10
PA10  (via drill 0.35)
  Top 0.203: U$3.PA10 17.39,14.11 v17.53,13.97 | v45.72,27.18 49.28,27.18 J2.2 | v30.23,21.34 v43.94,21.34
  Bottom 0.203: v17.53,13.97 22.86,13.97 v30.23,21.34 | v43.94,21.34 45.97,23.37 45.97,26.92 v45.72,27.18
PB0
  Top 0.203: U$3.PB0 12.08,18.43 5.59,11.94 5.59,10.92 J1.3
PB1
  Top 0.203: J1.2 6.35,9.14 6.35,11.43 12.55,17.63 U$3.PB1
PB4
  Top 0.203: U$3.PB4 24.75,18.43 30.73,12.45 J2.8
PB5
  Top 0.203: J2.7 30.48,14.99 26.24,19.23 U$3.PB5
SCL  (via drill 0.35)
  Top 0.203: U$3.PB6 26.96,20.03 29.46,17.53 v46.74,17.53 J2.6 | R13.1 v46.74,38.61
  Bottom 0.203: v46.74,17.53 v46.74,38.61 46.74,53.85 46.48,54.1 46.48,56.74 PCB1.5
SCLK  (via drill 0.35)
  Top 0.203: v24.13,53.34 U$1.13 24.13,50.8 19.3,45.97 11.18,45.97 J3.2
  Bottom 0.203: PCB1.23 22.38,57.63 23.62,56.39 23.62,53.85 v24.13,53.34
SDA  (via drill 0.35)
  Top 0.203: J2.5 v47.75,20.07 28.96,20.07 28.19,20.83 25.65,20.83 U$3.PB7 | R12.1 v47.75,36.83
  Bottom 0.203: v47.75,20.07 v47.75,36.83 47.75,53.59 49.02,54.86 49.02,56.74 PCB1.3
SILENT_PI  (via drill 0.35)
  Top 0.203: R5.1 16.26,35.31 v14.99,34.04
  Bottom 0.203: v14.99,34.04 15.17,34.22 U$2.8
SWCLK
  Top 0.203: U$3.PA14 20.59,13.2 21.08,12.7 21.08,3.3 18.9,1.12 11.43,1.12 10.41,2.13 SV1.4
SWDIO
  Top 0.203: U$3.PA13 19.79,13.94 16.51,10.67 16.51,5.59 15.49,4.57 SV1.2

### Text on the board
tPlace: Fix header pin labels
tNames: ROV CAN test board / V2 - Mon Year / Grant Geyer / Conner Swift | CS - MISO - MOSI - SCLK - GND | RX | GND - CAN_L - CAN_H | TX | 3V3 - PA0 - PA1 - PA2 - PA3 - PA4 - PA5 - PA6 - PA7 - PB0 - PB1 - GND | 5V - PA10- CAN_L- CAN_H- SDA - SCL - PB5 - PB4 - LED2 - PA9 - PA8 - GND | TX - RX | 3V3 - SWCLK - GND - SWDIO - NRST
bNames: CAN_H - CAN_L